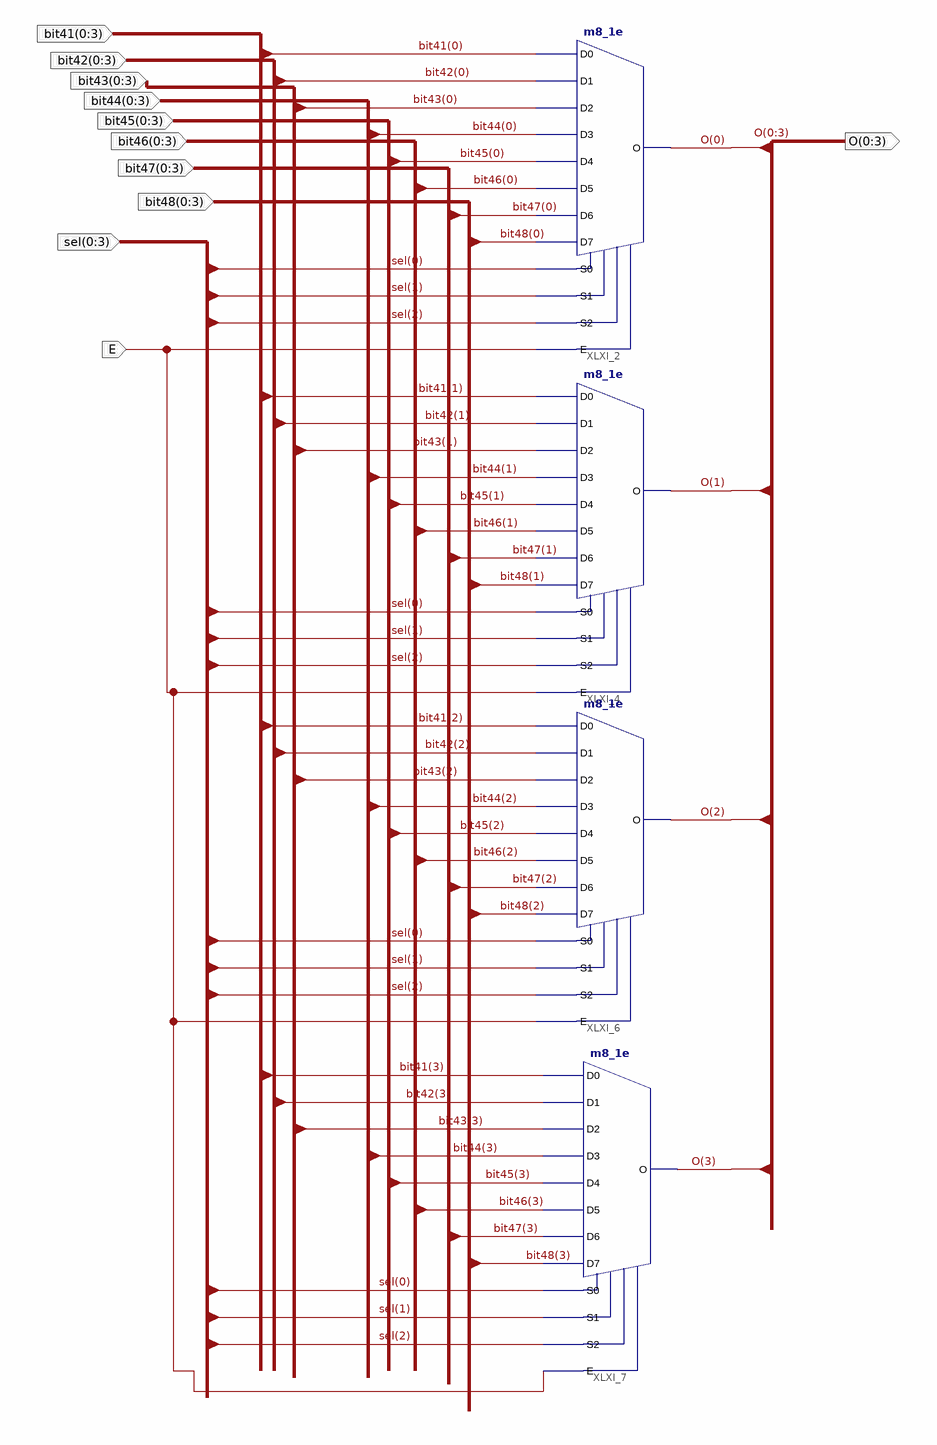
[diagram p0: schematic sheet 1]
// Xilinx ISE schematic mux81.sch (spartan3e) as structural Verilog: 4 symbols, 11 ports
module mux81 (
  input  [0:3] bit41,
  input  [0:3] bit42,
  input  [0:3] bit44,
  input  [0:3] bit45,
  input  [0:3] bit46,
  input  [0:3] bit48,
  input  [0:3] bit47,
  input  [0:3] sel,
  input  E,
  input  [0:3] bit43,
  output [0:3] O
);

  m8_1e XLXI_2 (
    .D0(bit41[0]), .D1(bit42[0]), .D2(bit43[0]), .D3(bit44[0]), .D4(bit45[0]), .D5(bit46[0]), .D6(bit47[0]),
    .D7(bit48[0]), .E(E), .S0(sel[0]), .S1(sel[1]), .S2(sel[2]), .O(O[0]));
  m8_1e XLXI_4 (
    .D0(bit41[1]), .D1(bit42[1]), .D2(bit43[1]), .D3(bit44[1]), .D4(bit45[1]), .D5(bit46[1]), .D6(bit47[1]),
    .D7(bit48[1]), .E(E), .S0(sel[0]), .S1(sel[1]), .S2(sel[2]), .O(O[1]));
  m8_1e XLXI_6 (
    .D0(bit41[2]), .D1(bit42[2]), .D2(bit43[2]), .D3(bit44[2]), .D4(bit45[2]), .D5(bit46[2]), .D6(bit47[2]),
    .D7(bit48[2]), .E(E), .S0(sel[0]), .S1(sel[1]), .S2(sel[2]), .O(O[2]));
  m8_1e XLXI_7 (
    .D0(bit41[3]), .D1(bit42[3]), .D2(bit43[3]), .D3(bit44[3]), .D4(bit45[3]), .D5(bit46[3]), .D6(bit47[3]),
    .D7(bit48[3]), .E(E), .S0(sel[0]), .S1(sel[1]), .S2(sel[2]), .O(O[3]));
endmodule
